# EAGLE design auxDaqUnitTopDigital2022 (EAGLE 9.6.2)
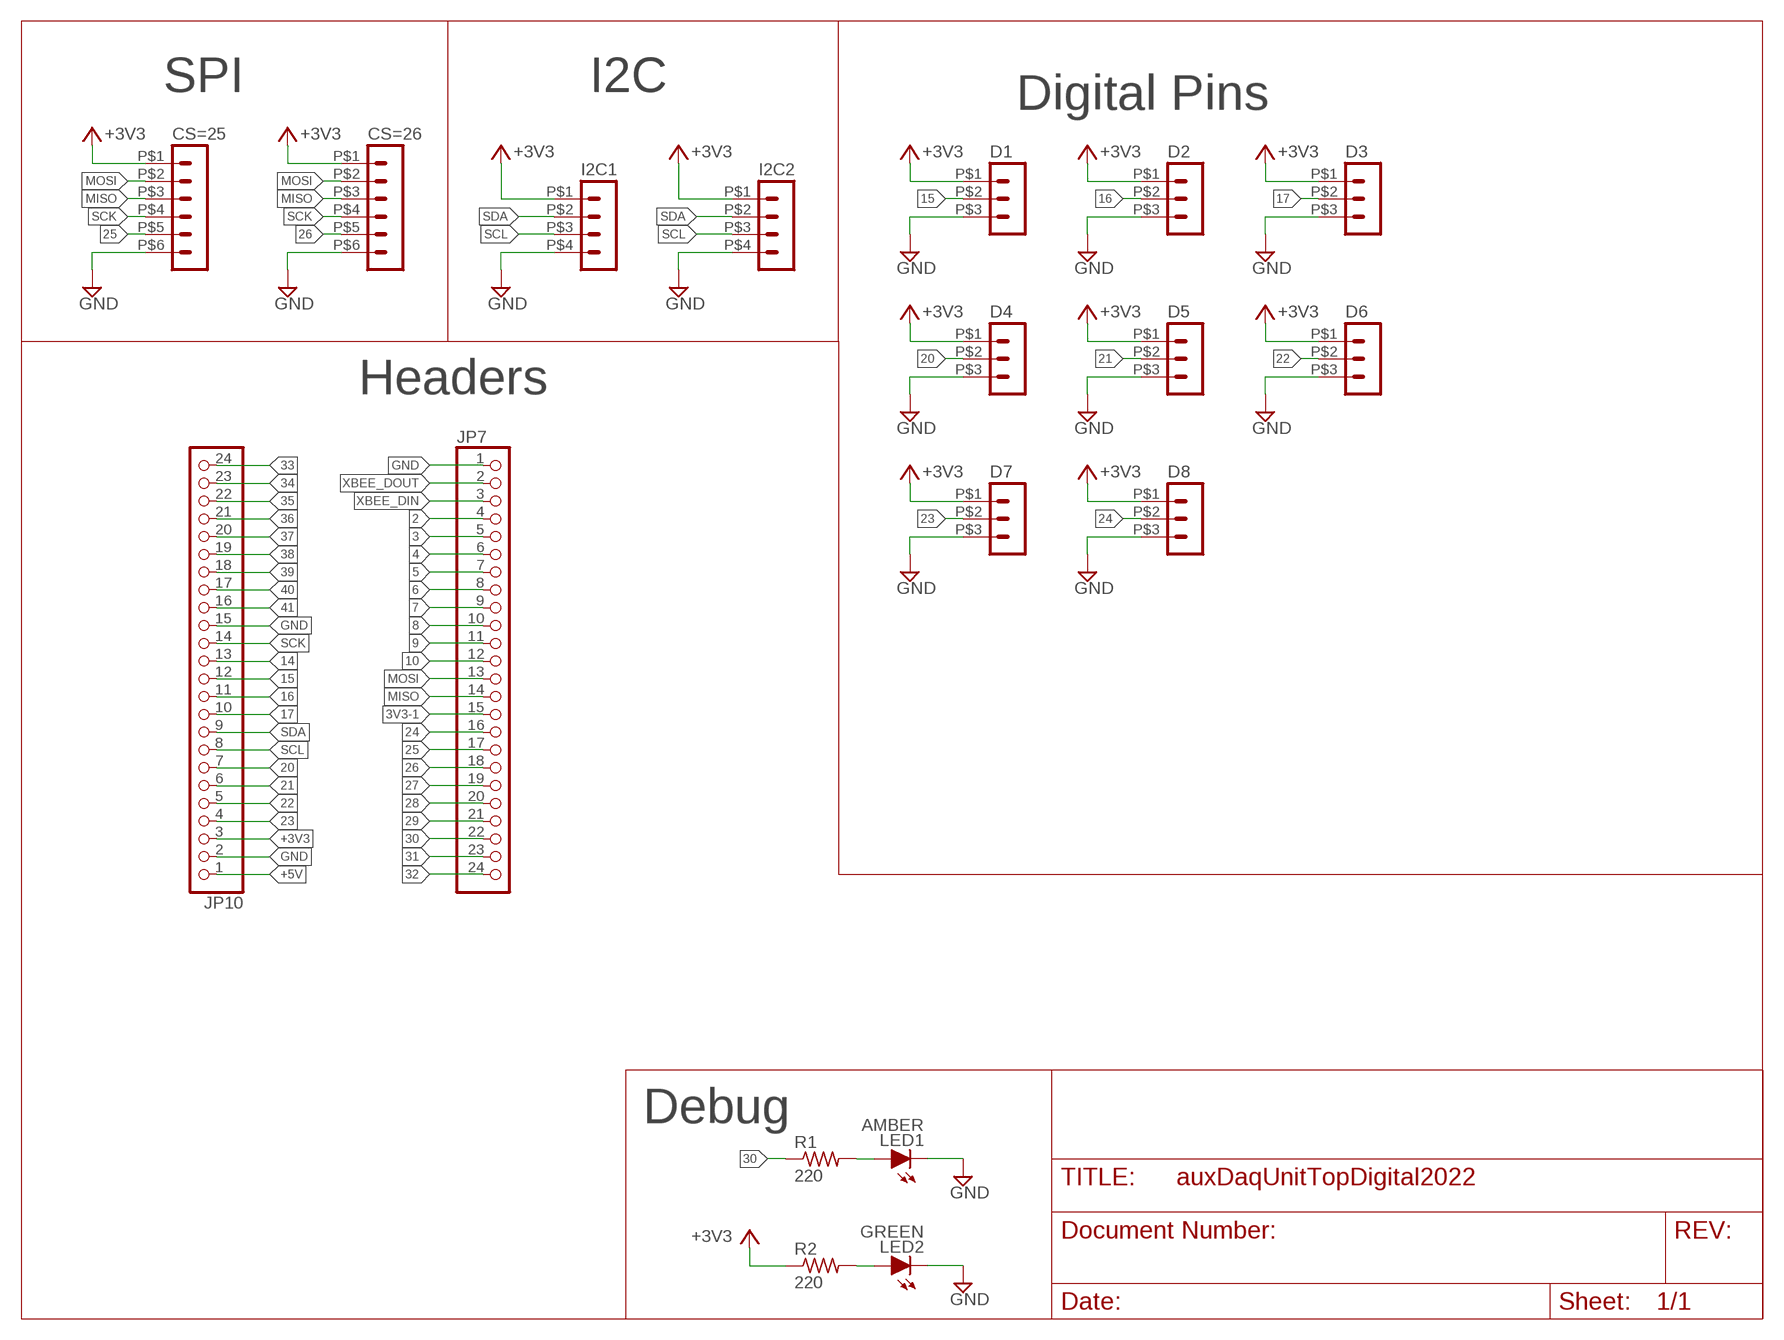
[diagram p0: schematic, sheet 1]
FRAME1 (LETTER_L): NAMEYEAR: PETER2022

## Parts
CS=25  HEADER_POS6_43045-0600  [43045-0600]
CS=26  HEADER_POS6_43045-0600  [43045-0600]
D1  HEADER_POS3_43650-0300  [43650-0300]
D2  HEADER_POS3_43650-0300  [43650-0300]
D3  HEADER_POS3_43650-0300  [43650-0300]
D4  HEADER_POS3_43650-0300  [43650-0300]
D5  HEADER_POS3_43650-0300  [43650-0300]
D6  HEADER_POS3_43650-0300  [43650-0300]
D7  HEADER_POS3_43650-0300  [43650-0300]
D8  HEADER_POS3_43650-0300  [43650-0300]
I2C1  HEADER_POS4_43045-0401  [43045-0400]
I2C2  HEADER_POS4_43045-0401  [43045-0400]
JP7  PINHD-1X24  [1X24]
JP10  PINHD-1X24  [1X24]
LED1  AMBER  LED-0603  [LED-603]
LED2  GREEN  LED-0603  [LED-603]
R1  220  RES_SMDR0603  [R0603]
R2  220  RES_SMDR0603  [R0603]

## Nets
2: JP7.4
3: JP7.5
3V3-1: JP7.15
4: JP7.6
5: JP7.7
6: JP7.8
7: JP7.9
8: JP7.10
9: JP7.11
10: JP7.12
14: JP10.13
15: D1.P$2 JP10.12
16: D2.P$2 JP10.11
17: D3.P$2 JP10.10
20: D4.P$2 JP10.7
21: D5.P$2 JP10.6
22: D6.P$2 JP10.5
23: D7.P$2 JP10.4
24: D8.P$2 JP7.16
25: CS=25.P$5 JP7.17
26: CS=26.P$5 JP7.18
27: JP7.19
28: JP7.20
29: JP7.21
30: JP7.22 R1.1
31: JP7.23
32: JP7.24
33: JP10.24
34: JP10.23
35: JP10.22
36: JP10.21
37: JP10.20
38: JP10.19
39: JP10.18
40: JP10.17
41: JP10.16
+3V3: CS=25.P$1 CS=26.P$1 D1.P$1 D2.P$1 D3.P$1 D4.P$1 D5.P$1 D6.P$1 D7.P$1 D8.P$1 I2C1.P$1 I2C2.P$1 JP10.3 R2.1
+5V: JP10.1
GND: CS=25.P$6 CS=26.P$6 D1.P$3 D2.P$3 D3.P$3 D4.P$3 D5.P$3 D6.P$3 D7.P$3 D8.P$3 I2C1.P$4 I2C2.P$4 JP7.1 JP10.2 JP10.15 LED1.C LED2.C
MISO: CS=25.P$3 CS=26.P$3 JP7.14
MOSI: CS=25.P$2 CS=26.P$2 JP7.13
N$1: LED1.A R1.2
N$2: LED2.A R2.2
SCK: CS=25.P$4 CS=26.P$4 JP10.14
SCL: I2C1.P$3 I2C2.P$3 JP10.8
SDA: I2C1.P$2 I2C2.P$2 JP10.9
XBEE_DIN: JP7.3
XBEE_DOUT: JP7.2

## Notes on the sheet
- SPI | I2C
- Digital Pins
- Headers
- Debug

## Library data of the parts
CS=25 CS=26 = GTOR - Microfit Connector:HEADER_POS6_?: Molex - Micro-Fit 3.0 Series connector, 3.00mm (0.118") pitch header, 6 positions.
D1-D8 = GTOR - Microfit Connector:HEADER_POS3_?: Molex - Micro-Fit 3.0 Series connector, 3.00mm (0.118") pitch header, 3 positions.
I2C1 I2C2 = GTOR - Microfit Connector:HEADER_POS4_?: Molex - Micro-Fit 3.0 Series connector, 3.00mm (0.118") pitch header, 4 positions.
JP7 JP10 = GTOR - Connectors:PINHD-1X24: PIN HEADER
LED1 LED2 = GTOR - Passive Components:LED: Light Emitting Diode (LED) Source: Dangerous Prototypes Eagle Library <https://github.com/DangerousPrototypes/Eagle_Part_Library>
R1 R2 = GTOR - Passive Components:RES_SMD: RESISTOR, American symbol; SPICEPREFIX: R

## Board
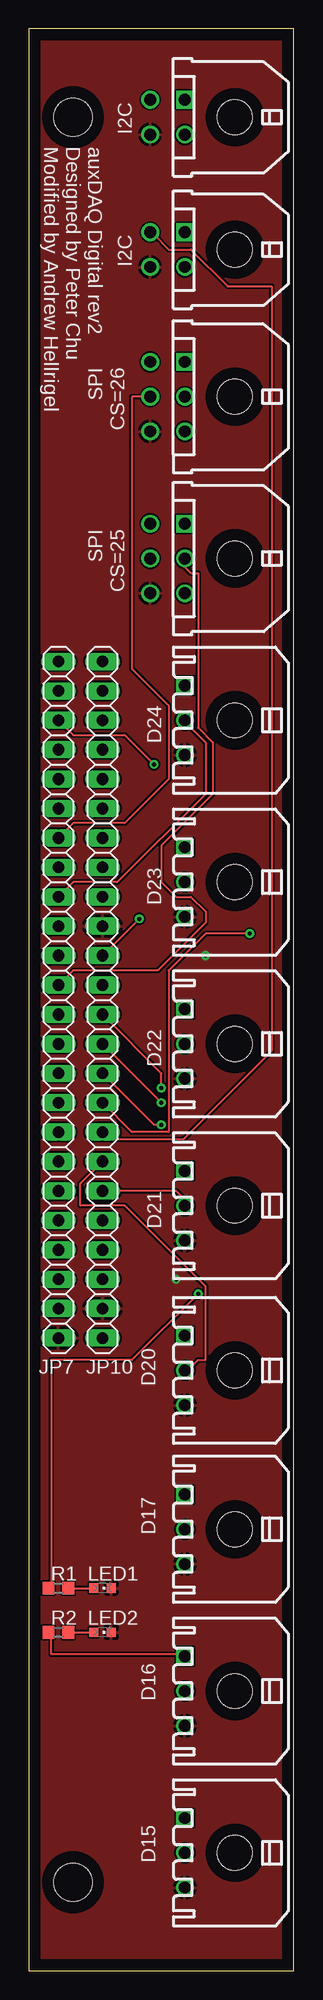
[diagram p1: board, top side]
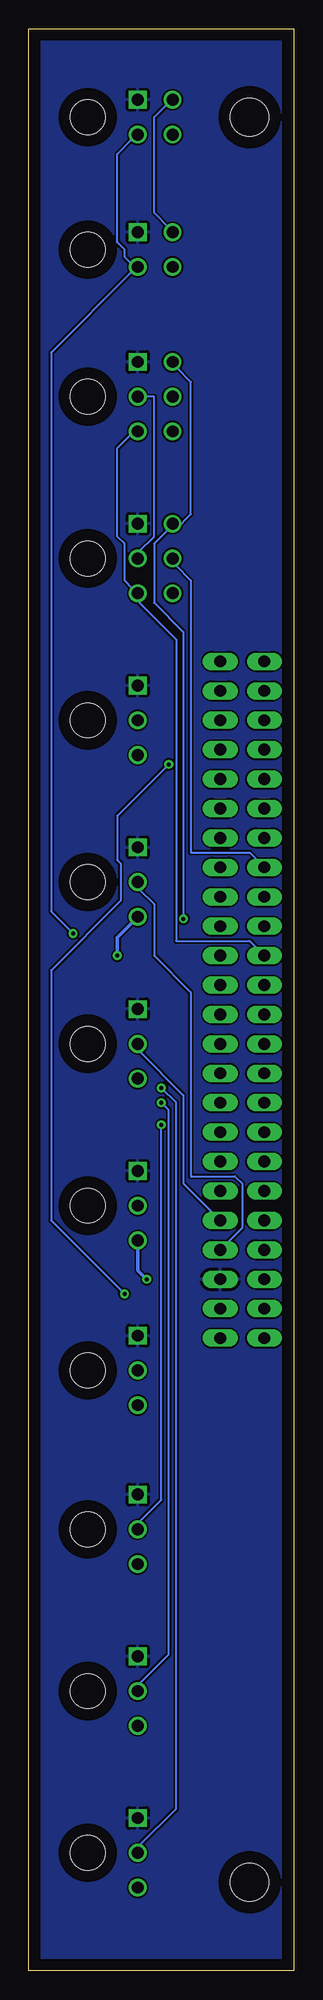
[diagram p2: board, bottom side, seen from below]

Size 22.86 x 167.64 mm. Coordinates in mm from the lower left corner, seen from the top.
Outline: 0,0 22.86,0 22.86,167.64 0,167.64 0,0
Copper layers (1*16): Top 0.035mm / dielectric 1.5mm / Bottom 0.035mm
Design rules "default": minimum track width 6mil, minimum drill 0.35mm, track to track 6mil, track to pad 6mil, pad to pad 6mil, via to via 6mil, smd to smd 6mil, copper to edge 40mil, drill to drill 6mil, minimum pad ring 10mil, minimum via ring 8mil, stop-mask expansion 4mil, vias tented up to drill 0mil, thermal gap 10mil
Holes 3.3 mm at 3.81,7.62 3.81,160.02

### Footprints (pad centres in the part's own frame; a part is rotated, then mirrored left to right if it is on the bottom)
43045-0600 = drill 1.02 square: P$1 3,4.32 | drill 1.02: P$2 0,4.32; P$3 -3,4.32; P$4 3,7.32; P$5 0,7.32; P$6 -3,7.32 | hole 3: 0,0
43650-0300 = drill 1.02 square: P$1 3,4.32 | drill 1.02: P$2 0,4.32; P$3 -3,4.32 | hole 3: 0,0
43045-0400 = drill 1.02 square: P$1 1.5,4.32 | drill 1.02: P$2 -1.5,4.32; P$3 1.5,7.32; P$4 -1.5,7.32 | hole 3: 0,0
1X24 = drill 1.016 long: 1 -29.21,0; 2 -26.67,0; 3 -24.13,0; 4 -21.59,0; 5 -19.05,0; 6 -16.51,0; 7 -13.97,0; 8 -11.43,0; 9 -8.89,0; 10 -6.35,0; 11 -3.81,0; 12 -1.27,0; 13 1.27,0; 14 3.81,0; 15 6.35,0; 16 8.89,0; 17 11.43,0; 18 13.97,0; 19 16.51,0; 20 19.05,0; 21 21.59,0; 22 24.13,0; 23 26.67,0; 24 29.21,0
LED-603 = smd 0.8 x 0.8: A 0,-0.75; C 0,0.75
R0603 = smd 1 x 1.1: 1 -0.85,0; 2 0.85,0

### Placement (x,y rotation side)
CS=25  17.78,121.92 90 top
CS=26  17.78,135.89 90 top
D1  17.78,10.16 90 top
D2  17.78,24.13 90 top
D3  17.78,38.1 90 top
D4  17.78,51.82 90 top
D5  17.78,66.04 90 top
D6  17.78,80.01 90 top
D7  17.78,93.98 90 top
D8  17.78,107.95 90 top
I2C1  17.78,160.02 90 top
I2C2  17.78,148.59 90 top
JP7  2.54,83.82 90 top
JP10  6.35,83.82 90 top
LED1  6.35,33.02 270 top
LED2  6.35,29.21 270 top
R1  2.54,33.02 0 top
R2  2.54,29.21 0 top

### Tracks (layer width: path | path; a pad name or v marks a point on that pad's centre or on a via)
15  (via drill 0.35)
  Top 0.152: JP10.12 11.43,77.47 v11.43,76.2
  Bottom 0.152: v11.43,76.2 10.16,74.93 10.16,13.97 13.33,10.79 13.33,10.16 D1.P$2
16  (via drill 0.35)
  Top 0.152: v11.43,74.93 JP10.11
  Bottom 0.152: v11.43,74.93 10.8,74.3 10.8,27.3 13.33,24.77 13.33,24.13 D2.P$2
17  (via drill 0.35)
  Top 0.152: JP10.10 10.8,73.03 v11.43,73.03
  Bottom 0.152: v11.43,73.03 11.43,40.64 13.33,38.73 13.33,38.1 D3.P$2
20
  Top 0.152: JP10.7 4.44,67.94 4.44,66.04 8.25,66.04 15.24,59.05 15.24,52.7 14.61,52.7 13.97,52.07 D4.P$2
21
  Top 0.152: JP10.6 12.7,67.31 13.97,66.04 D5.P$2
22
  Bottom 0.152: JP10.5 9.52,67.94 9.52,75.56 13.33,79.38 13.33,80.01 D6.P$2
23
  Bottom 0.152: JP10.4 4.44,64.14 4.44,67.94 5.08,68.58 8.89,68.58 8.89,84.45 12.06,87.63 12.06,92.08 13.33,93.34 13.33,93.98 D7.P$2
24
  Top 0.152: JP7.16 3.81,93.98 7.62,93.98 15.24,101.6 15.24,106.05 13.33,107.95 D8.P$2
25
  Bottom 0.152: JP7.17 3.81,96.52 8.89,96.52 8.89,120.02 10.16,121.28 10.16,121.92 CS=25.P$5
26
  Top 0.152: JP7.18 3.81,99.06 8.25,99.06 12.06,102.87 12.06,109.22 8.89,112.39 8.89,135.89 CS=26.P$5
30  (via drill 0.35)
  Top 0.152: v14.61,58.42 8.89,52.7 1.91,52.7 1.91,33.02 R1.1 | v10.8,104.14 8.25,106.68 3.81,106.68 JP7.22
  Bottom 0.152: v14.61,58.42 20.95,64.77 20.95,86.36 14.92,92.39 14.92,95.57 15.24,95.89 15.24,99.69 v10.8,104.14
+3V3
  Top 0.152: R2.1 1.91,29.21 1.91,27.3 13.33,27.3 D2.P$1
  pour Bottom: -44.45,167.64 -44.45,-10.16 57.15,-10.16 57.15,167.64
GND  (via drill 0.35)
  Bottom 0.305: D5.P$3 13.46,60.45 v12.7,59.69 | D7.P$3 15.24,89.2 v15.24,87.63
  pour Top: 0,167.64 0,0 58.42,0 58.42,167.64
MISO
  Bottom 0.152: JP7.14 3.81,88.9 10.16,88.9 10.16,114.94 13.33,118.11 13.33,118.75 CS=25.P$3 13.97,119.38 14.61,120.02 14.61,123.19 15.24,123.83 15.24,131.44 13.97,132.72 CS=26.P$3
MOSI
  Top 0.152: JP7.13 3.81,86.36 11.11,86.36 15.24,90.49 15.24,91.44 13.97,92.71 12.7,92.71 11.43,93.98 11.43,97.16 15.88,101.6 15.88,106.05 14.61,107.31 14.61,120.65 13.97,120.65 13.33,121.28 13.33,121.92 CS=25.P$2
  Bottom 0.152: CS=26.P$2 12.06,135.89 12.06,123.83 13.33,122.56 13.33,121.92 CS=25.P$2
N$1
  Top 0.152: R1.2 LED1.A
N$2
  Top 0.152: R2.2 LED2.A
SCK  (via drill 0.35)
  Top 0.152: v9.52,90.81 JP10.14
  Bottom 0.152: v9.52,90.81 9.52,115.57 12.06,118.11 12.06,123.19 10.8,124.46 CS=25.P$4 10.16,124.46 8.89,125.73 8.89,137.16 10.16,138.43 CS=26.P$4
SCL
  Top 0.152: JP10.8 6.98,71.75 13.33,71.75 20.95,79.38 20.95,145.41 17.14,145.41 13.97,148.59 12.06,148.59 10.8,149.86 I2C2.P$3
  Bottom 0.152: I2C1.P$3 10.8,161.29 12.06,160.02 12.06,151.76 10.8,150.5 I2C2.P$3
SDA  (via drill 0.35)
  Top 0.152: JP10.9 8.89,72.39 12.06,72.39 12.06,86.36 15.24,89.53 v19.05,89.53
  Bottom 0.152: v19.05,89.53 20.95,91.44 20.95,139.7 13.97,146.69 I2C2.P$2 13.97,147.32 14.61,147.96 14.61,148.59 15.24,149.22 15.24,156.84 13.97,158.12 I2C1.P$2

### Text on the board
tNames: I2C | auxDAQ Digital rev2 / Designed by Peter Chu / Modified by Andrew Hellrigel | I2C | SPI / CS=26 | SPI / CS=25 | D24 | D23 | D22 | D21 | D20 | D17 | D16 | D15
tValues: SPI